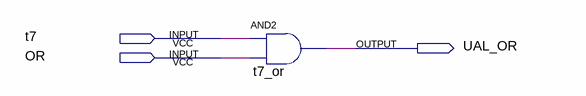
[diagram p0: schematic sheet]
// Quartus schematic ual_or.bdf as structural Verilog: 1 symbols, 3 pins
module ual_or (
  input  t7,
  input  OR,
  output UAL_OR
);

  and t7_or (UAL_OR, t7, OR);
endmodule
